# EAGLE board PCB (EAGLE 9.6.2), part 1 of 2
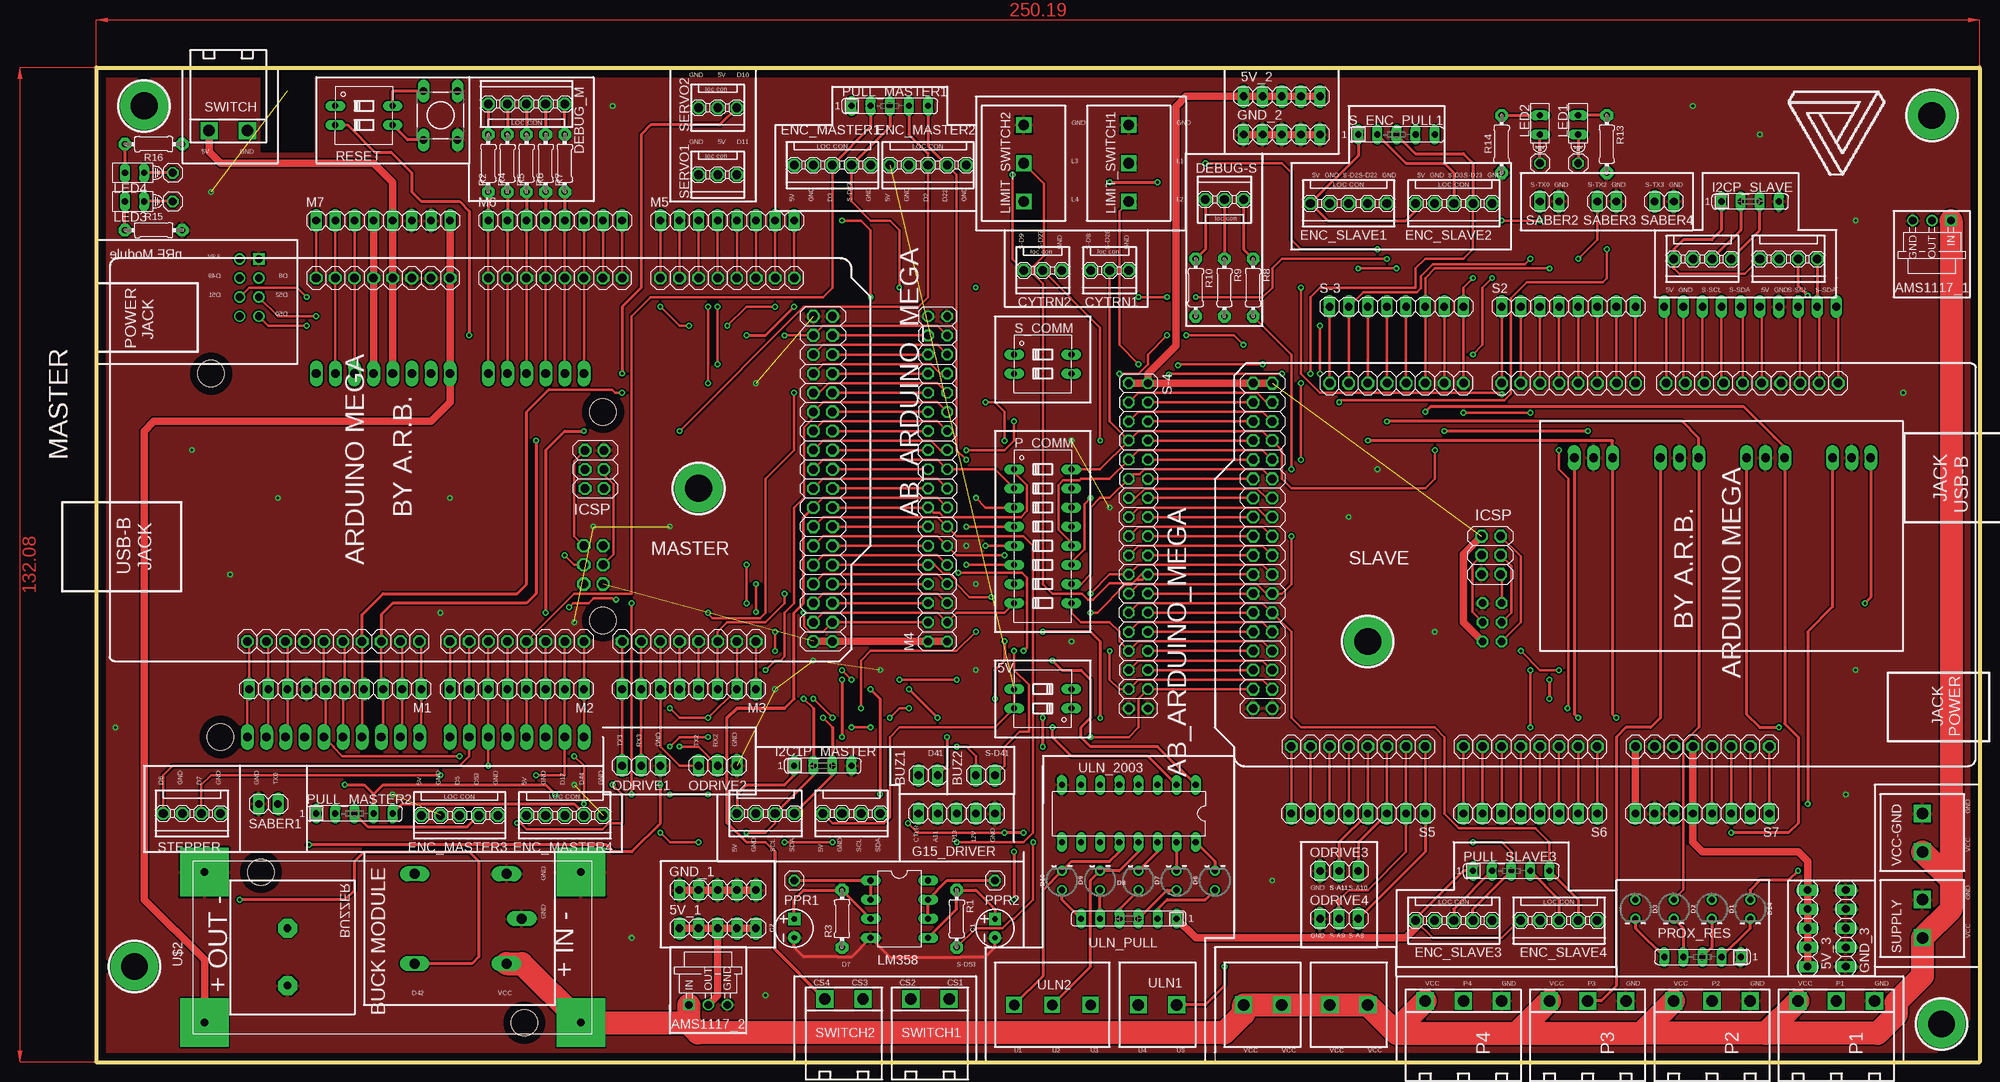
[diagram p1: board, top side]
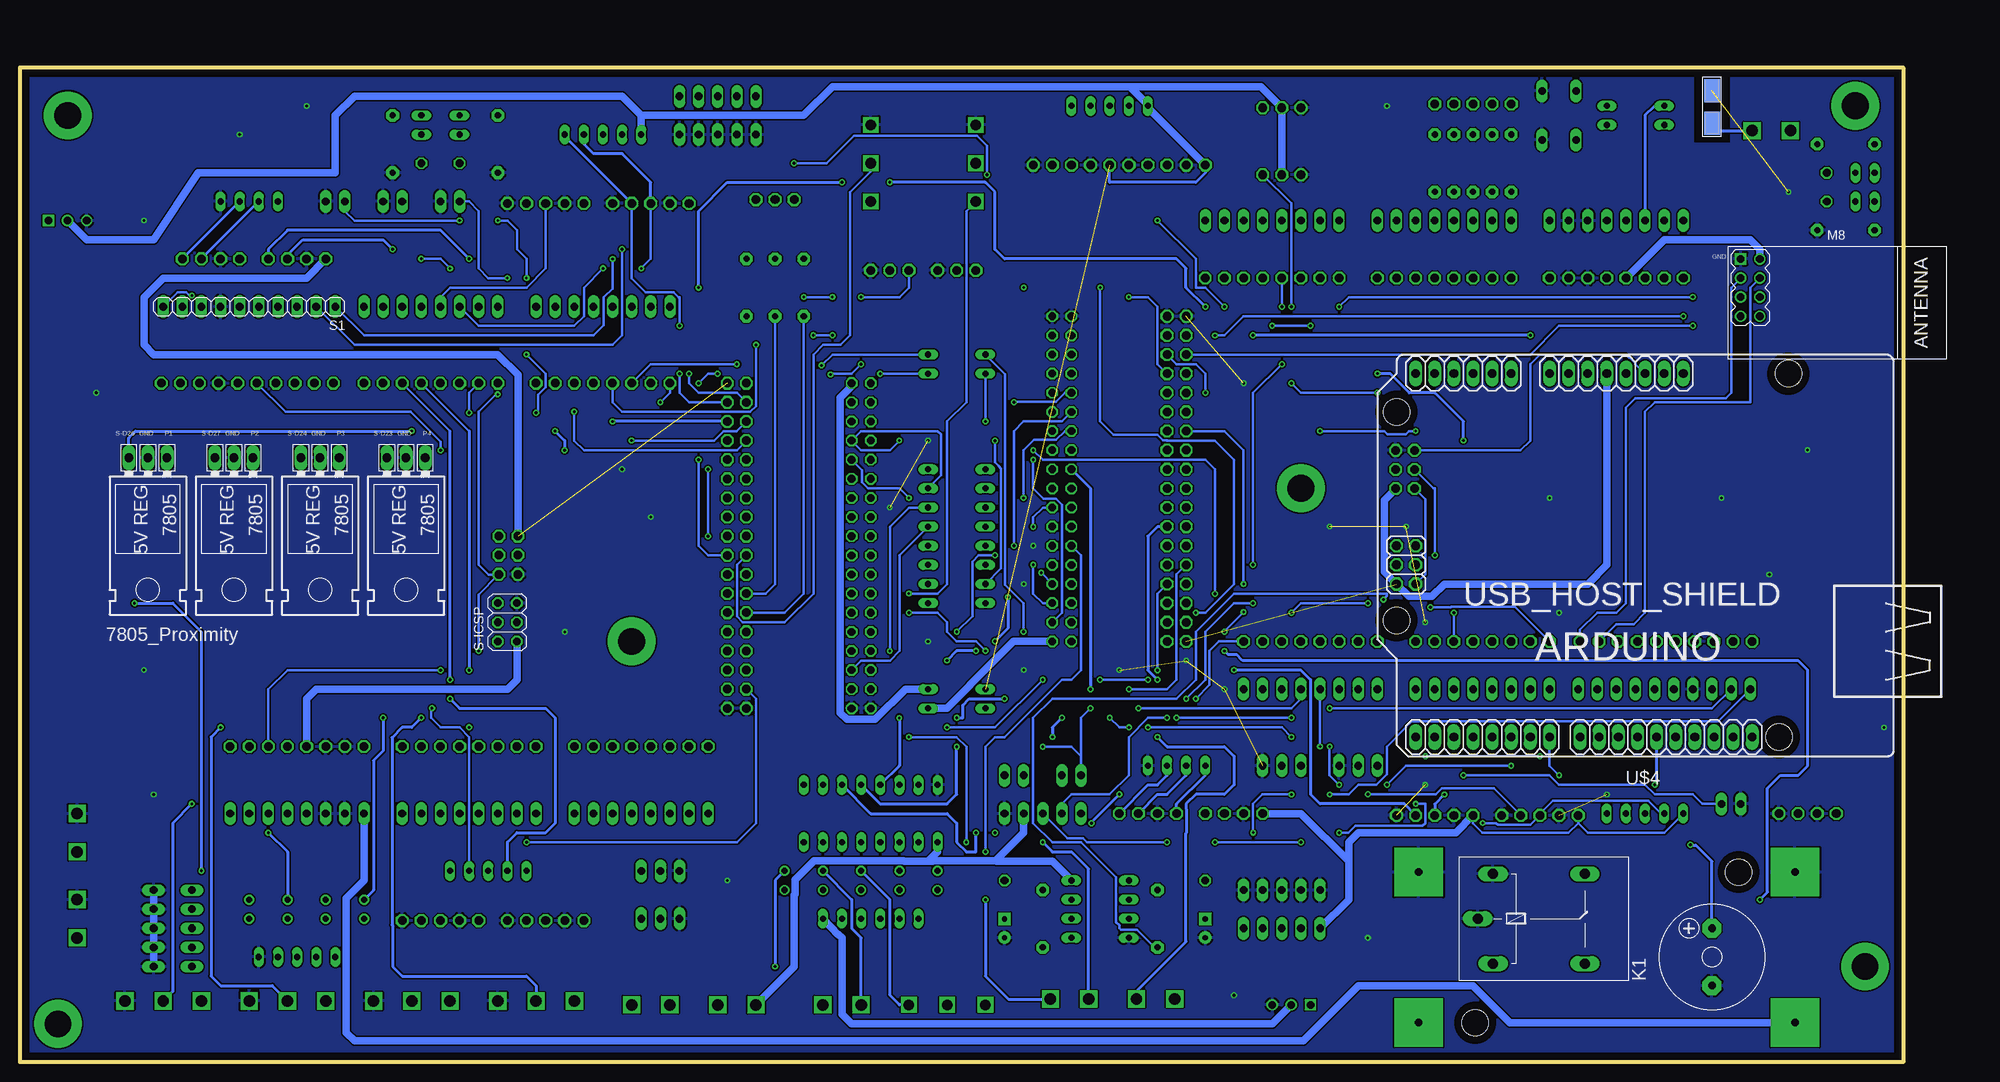
[diagram p2: board, bottom side, seen from below]

Size 250.19 x 132.08 mm. Coordinates in mm from the lower left corner, seen from the top.
Outline: 0,132.08 0,0 250.19,0 250.19,132.08 0,132.08
Copper layers (1*16): Top 0.035mm / dielectric 1.5mm / Bottom 0.035mm
Design rules "default *": minimum track width 10mil, minimum drill 0.35mm, track to track 6mil, track to pad 6mil, pad to pad 6mil, via to via 6mil, smd to smd 6mil, copper to edge 40mil, drill to drill 6mil, minimum pad ring 10mil, minimum via ring 8mil, stop-mask expansion 4mil, vias tented up to drill 0mil, thermal gap 10mil
Net classes: 0 default: width 0.127 mm, drill 0.279 mm, clearance 0.203 mm; 1 arduino master: width 0.305 mm, drill 0.356 mm, clearance 0.254 mm; 2 arduino slave: width 0.305 mm, drill 0.356 mm, clearance 0.254 mm; 3 proximity: width 0.406 mm, drill 0.381 mm, clearance 0.305 mm; 4 vin: width 1.016 mm, drill 0.356 mm, clearance 0.305 mm

## Footprints (pad centres in the part's own frame; a part is rotated, then mirrored left to right if it is on the bottom)
DIP02YL = drill 0.813 long: 1 -1.27,-3.81; 2 1.27,-3.81; 3 1.27,3.81; 4 -1.27,3.81
1X05 = drill 1.016 long: 1 -5.08,0; 2 -2.54,0; 3 0,0; 4 2.54,0; 5 5.08,0
REG-AMS1117-3P#V = drill 1 square: 1 -2.54,-5.08 | drill 1: 2 0,-5.08; 3 2.54,-5.08
1X02 = drill 1.016 long: 1 -1.27,0; 2 1.27,0
F/CM12P = drill 1.016 pad 2.54 octagon: + 3.81,0; - -3.81,0
CPOL-RADIAL-2.5MM-5MM = drill 0.7 pad 1.651 square: 1 1.25,0 | drill 0.7 pad 1.651: 2 -1.25,0
AB_3PIN_LOC_CONNECTOR = drill 1.143 octagon: 1 -1.524,-2.54; 2 -1.524,0; 3 -1.524,2.54
LED_3MM-NS = drill 0.813: A -1.27,0; K 1.27,0
AB_5PIN_LOC_CONNECTOR = drill 1.143 octagon: 1 -1.524,-5.08; 2 -1.524,-2.54; 3 -1.524,0; 4 -1.524,2.54; 5 -1.524,5.08
SIL4 = drill 0.813 long: 1 -3.81,0; 2 -1.27,0; 3 1.27,0; 4 3.81,0
AB_4PIN_LOC_CONNECTOR = drill 1.143 octagon: 1 0,-3.81; 2 0,-1.27; 3 0,1.27; 4 0,3.81
G5LE = drill 1.321 long: 1 -7.493,-5.969; 2 -7.493,5.969; O 4.699,5.969; P -9.525,0; S 4.699,-5.969
HLMP6 = drill 0.813 long: A -1.27,0; K 1.27,0
AB_SCREW_TER_5MM_3PIN = drill 1.397 square: 1 2.54,5.08; 2 2.54,0; 3 2.54,-5.08
DIL08 = drill 0.813 long: 1 -3.81,-3.81; 2 -1.27,-3.81; 3 1.27,-3.81; 4 3.81,-3.81; 5 3.81,3.81; 6 1.27,3.81; 7 -1.27,3.81; 8 -3.81,3.81
1X10 = drill 1.016 long: 1 -11.43,0; 2 -8.89,0; 3 -6.35,0; 4 -3.81,0; 5 -1.27,0; 6 1.27,0; 7 3.81,0; 8 6.35,0; 9 8.89,0; 10 11.43,0
1X08 = drill 1.016 long: 1 -8.89,0; 2 -6.35,0; 3 -3.81,0; 4 -1.27,0; 5 1.27,0; 6 3.81,0; 7 6.35,0; 8 8.89,0
2X18 = drill 1.016 octagon: 1 -21.59,-1.27; 2 -21.59,1.27; 3 -19.05,-1.27; 4 -19.05,1.27; 5 -16.51,-1.27; 6 -16.51,1.27; 7 -13.97,-1.27; 8 -13.97,1.27; 9 -11.43,-1.27; 10 -11.43,1.27; 11 -8.89,-1.27; 12 -8.89,1.27; 13 -6.35,-1.27; 14 -6.35,1.27; 15 -3.81,-1.27; 16 -3.81,1.27; 17 -1.27,-1.27; 18 -1.27,1.27; 19 1.27,-1.27; 20 1.27,1.27; 21 3.81,-1.27; 22 3.81,1.27; 23 6.35,-1.27; 24 6.35,1.27; 25 8.89,-1.27; 26 8.89,1.27; 27 11.43,-1.27; 28 11.43,1.27; 29 13.97,-1.27; 30 13.97,1.27; 31 16.51,-1.27; 32 16.51,1.27; 33 19.05,-1.27; 34 19.05,1.27; 35 21.59,-1.27; 36 21.59,1.27
WIRELESS-NRF24L01 = drill 1 square: 1 -12.7,6.35 | drill 1: 2 -10.16,6.35; 3 -12.7,3.81; 4 -10.16,3.81; 5 -12.7,1.27; 6 -10.16,1.27; 7 -12.7,-1.27; 8 -10.16,-1.27
AB_ARDUINO_MEGA = drill 1.13 octagon: 3V3 24.13,21.59; 5V 24.13,19.05; 5V1 -24.13,-36.83; 5V2 -24.13,-39.37; 5V3 -3.81,-9.017; - 24.13,29.21; A0 24.13,6.35; A1 24.13,3.81; A2 24.13,1.27; A3 24.13,-1.27; A4 24.13,-3.81; A5 24.13,-6.35; A6 24.13,-8.89; A7 24.13,-11.43; A8 24.13,-16.51; A9 24.13,-19.05; A10 24.13,-21.59; A11 24.13,-24.13; A12 24.13,-26.67; A13 24.13,-29.21; A14 24.13,-31.75; A15 24.13,-34.29; AREF -24.13,33.274; D2 -24.13,-1.27; D3 -24.13,1.27; D4 -24.13,3.81; D5 -24.13,6.35; D6 -24.13,8.89; D7 -24.13,11.43; D8 -24.13,15.494; D9 -24.13,18.034; D10 -24.13,20.574; D11 -24.13,23.114; D12 -24.13,25.654; D13 -24.13,28.194; D22 -21.59,-36.83; D23 -21.59,-39.37; D24 -19.05,-36.83; D25 -19.05,-39.37; D26 -16.51,-36.83; D27 -16.51,-39.37; D28 -13.97,-36.83; D29 -13.97,-39.37; D30 -11.43,-36.83; D31 -11.43,-39.37; D32 -8.89,-36.83; D33 -8.89,-39.37; D34 -6.35,-36.83; D35 -6.35,-39.37; D36 -3.81,-36.83; D37 -3.81,-39.37; D38 -1.27,-36.83; D39 -1.27,-39.37; D40 1.27,-36.83; D41 1.27,-39.37; D42 3.81,-36.83; D43 3.81,-39.37; D44 6.35,-36.83; D45 6.35,-39.37; D46 8.89,-36.83; D47 8.89,-39.37; D48 11.43,-36.83; D49 11.43,-39.37; D50 13.97,-36.83; D51 13.97,-39.37; D52 16.51,-36.83; D53 16.51,-39.37; GD3 19.05,-36.83; GD4 19.05,-39.37; GND 24.13,13.97; GND1 24.13,16.51; GND2 -24.13,30.734; GND5 1.245,-9.017; IOREF 24.13,26.67; MISO -3.81,-6.502; MOSI -1.295,-9.017; RST 24.13,24.13; RST1 1.245,-6.502; RX0 -24.13,-6.35; RX1 -24.13,-24.13; RX2 -24.13,-19.05; RX3 -24.13,-13.97; SCK -1.295,-6.502; SCL -24.13,-29.21; SCLU -24.13,38.354; SDA -24.13,-26.67; SDAU -24.13,35.814; TX0 -24.13,-3.81; TX1 -24.13,-21.59; TX2 -24.13,-16.51; TX3 -24.13,-11.43; VIN 24.13,11.43
1X03 = drill 1.016 long: 1 -2.54,0; 2 0,0; 3 2.54,0
AB_RIGHT_TER_BLK_3PIN = drill 1.524 square: 1 -5.588,5.08; 2 -5.588,0; 3 -5.588,-5.08
DIP08YL = drill 0.813 long: 1 -8.89,-3.81; 2 -6.35,-3.81; 3 -3.81,-3.81; 4 -1.27,-3.81; 5 1.27,-3.81; 6 3.81,-3.81; 7 6.35,-3.81; 8 8.89,-3.81; 9 8.89,3.81; 10 6.35,3.81; 11 3.81,3.81; 12 1.27,3.81; 13 -1.27,3.81; 14 -3.81,3.81; 15 -6.35,3.81; 16 -8.89,3.81
1X01 = drill 1.016 octagon: 1 0,0
SIL5 = drill 0.813 long: 1 -5.08,0; 2 -2.54,0; 3 0,0; 4 2.54,0; 5 5.08,0
0204/7 = drill 0.813 pad 1.676 octagon: 1 -3.81,0; 2 3.81,0
DTS-6 = drill 1 long: 1 -3.25,2.25; 2 3.25,2.25; 3 -3.25,-2.25; 4 3.25,-2.25
2X03 = drill 1.016 octagon: 1 -2.54,-1.27; 2 -2.54,1.27; 3 0,-1.27; 4 0,1.27; 5 2.54,-1.27; 6 2.54,1.27
AB_SCREW_TERMINAL_5MM_2PIN = drill 1.524 square: 1 0,2.54; 2 0,-2.54
AB_RIGHT_TER_BLK = drill 1.524 square: 1 -5.842,2.794; 2 -5.842,-2.286
BUCK_MODULE = drill 1 pad 6.452 square: 1 -10,-25; 2 10,-25; 3 -10,25; 4 10,25 | hole 3.5: -10,-17.5; 10,17.5
PLATED_DRILL_3.5MM = drill 3.556 pad 6.35: 1 0,0
AB_USB_HOST_SHIELD_ARDUINO = drill 1.143 long: 3V3 1.27,-24.13; 5V1 3.81,-24.13; - -6.35,-24.13; A0 16.51,-24.13; A1 19.05,-24.13; A2 21.59,-24.13; A3 24.13,-24.13; A4 26.67,-24.13; A5 29.21,-24.13; AREF -10.414,24.13; D2 24.13,24.13; D3 21.59,24.13; D4 19.05,24.13; D5 16.51,24.13; D6 13.97,24.13; D7 11.43,24.13; D8 7.366,24.13; D9 4.826,24.13; D10 2.286,24.13; D11 -0.254,24.13; D12 -2.794,24.13; D13 -5.334,24.13; GND -7.874,24.13; GND2 8.89,-24.13; GND3 6.35,-24.13; RST1 -1.27,-24.13; RX0 29.21,24.13; SCL -15.494,24.13; SDA -12.954,24.13; TX0 26.67,24.13; VIN 11.43,-24.13; VREF -3.81,-24.13 | drill 1.168 octagon: 5V 31.75,3.81; GND1 31.75,-1.27; MISO 29.21,3.81; MOSI 31.75,1.27; RST 29.21,-1.27; SCK 29.21,1.27 | hole 3.56: 31.75,-19.05; 31.75,8.636; -19.05,24.13; -20.32,-24.13
AB_7805_FLAT = drill 1.143 long: 1 -7.874,1.778; 2 -7.874,-0.762; 3 -7.874,-3.302
AB_JUMPER_ONE_WAY = smd 3.048 x 2.032: 1 -2.286,0; 2 2.032,0
DIL16 = drill 0.813 long: 1 -8.89,-3.81; 2 -6.35,-3.81; 3 -3.81,-3.81; 4 -1.27,-3.81; 5 1.27,-3.81; 6 3.81,-3.81; 7 6.35,-3.81; 8 8.89,-3.81; 9 8.89,3.81; 10 6.35,3.81; 11 3.81,3.81; 12 1.27,3.81; 13 -1.27,3.81; 14 -3.81,3.81; 15 -6.35,3.81; 16 -8.89,3.81
SIL6 = drill 0.813 long: 1 -6.35,0; 2 -3.81,0; 3 -1.27,0; 4 1.27,0; 5 3.81,0; 6 6.35,0

## Placement (x,y rotation side)
5V  [DIP02YL]  125.73,48.26 90 top
5V_1  [1X05]  82.55,17.78 0 top
5V_2  [1X05]  157.48,128.27 180 top
5V_3  [1X05]  227.33,17.78 270 top
AMS1117_1  REG-AMS1117-3P-5.0V#V  [REG-AMS1117-3P#V]  243.84,106.68 180 top
AMS1117_2  REG-AMS1117-3P-5.0V#V  [REG-AMS1117-3P#V]  81.28,12.7 0 top
BUZ1  [1X02]  110.49,38.1 0 top
BUZ2  [1X02]  118.11,38.1 0 top
BUZZER  F/CM12P  [F/CM12P]  25.4,13.97 90 bottom
C1  10uF  [CPOL-RADIAL-2.5MM-5MM]  119.38,17.78 90 top
C2  10uF  [CPOL-RADIAL-2.5MM-5MM]  92.71,17.78 90 top
CYTRN1  AB_3PIN_LOC_CONNECTOR  [AB_3PIN_LOC_CONNECTOR]  134.62,106.68 90 top
CYTRN2  AB_3PIN_LOC_CONNECTOR  [AB_3PIN_LOC_CONNECTOR]  125.73,106.68 90 top
D1  [LED_3MM-NS]  214.63,20.32 270 top
D2  [LED_3MM-NS]  209.55,20.32 270 top
D3  [LED_3MM-NS]  204.47,20.32 270 top
D6  [LED_3MM-NS]  148.59,24.13 90 top
D7  [LED_3MM-NS]  143.51,24.13 90 top
D8  [LED_3MM-NS]  138.43,24.13 90 top
D9  [LED_3MM-NS]  133.35,24.13 90 top
D10  [LED_3MM-NS]  128.27,24.13 90 top
D14  [LED_3MM-NS]  219.71,20.32 270 top
DEBUG-S  AB_3PIN_LOC_CONNECTOR  [AB_3PIN_LOC_CONNECTOR]  149.86,113.03 270 top
DEBUG_M  AB_5PIN_LOC_CONNECTOR  [AB_5PIN_LOC_CONNECTOR]  57.15,125.73 270 top
ENC_MASTER1  AB_5PIN_LOC_CONNECTOR  [AB_5PIN_LOC_CONNECTOR]  97.79,120.65 90 top
ENC_MASTER2  AB_5PIN_LOC_CONNECTOR  [AB_5PIN_LOC_CONNECTOR]  110.49,120.65 90 top
ENC_MASTER3  AB_5PIN_LOC_CONNECTOR  [AB_5PIN_LOC_CONNECTOR]  48.26,34.29 90 top
ENC_MASTER4  AB_5PIN_LOC_CONNECTOR  [AB_5PIN_LOC_CONNECTOR]  62.23,34.29 90 top
ENC_SLAVE1  AB_5PIN_LOC_CONNECTOR  [AB_5PIN_LOC_CONNECTOR]  166.37,115.57 90 top
ENC_SLAVE2  AB_5PIN_LOC_CONNECTOR  [AB_5PIN_LOC_CONNECTOR]  180.34,115.57 90 top
ENC_SLAVE3  AB_5PIN_LOC_CONNECTOR  [AB_5PIN_LOC_CONNECTOR]  180.34,20.32 90 top
ENC_SLAVE4  AB_5PIN_LOC_CONNECTOR  [AB_5PIN_LOC_CONNECTOR]  194.31,20.32 90 top
G15_DRIVER  [1X05]  114.3,33.02 180 top
GND_1  [1X05]  82.55,22.86 0 top
GND_2  [1X05]  157.48,123.19 180 top
GND_3  [1X05]  232.41,17.78 270 top
I2C1P_MASTER  [SIL4]  96.52,39.37 0 top
I2CP_SLAVE  [SIL4]  219.71,114.3 0 top
IMU_BLOCK2  AB_4PIN_LOC_CONNECTOR  [AB_4PIN_LOC_CONNECTOR]  100.33,33.02 90 top
IMU_BLOCK3  AB_4PIN_LOC_CONNECTOR  [AB_4PIN_LOC_CONNECTOR]  213.36,106.68 90 top
IMU_BLOCK4  AB_4PIN_LOC_CONNECTOR  [AB_4PIN_LOC_CONNECTOR]  224.79,106.68 90 top
IMU_MASTER  AB_4PIN_LOC_CONNECTOR  [AB_4PIN_LOC_CONNECTOR]  88.9,33.02 90 top
K1  G5LE  [G5LE]  46.99,19.05 0 bottom
LED1  HLMP6  [HLMP6]  196.85,124.46 90 top
LED2  HLMP6  [HLMP6]  191.77,124.46 90 top
LED3  HLMP6  [HLMP6]  5.08,114.3 180 top
LED4  HLMP6  [HLMP6]  5.08,118.11 180 top
LIMIT_SWITCH1  AB_SCREW_TER_5MM_3PIN  [AB_SCREW_TER_5MM_3PIN]  139.7,119.38 180 top
LIMIT_SWITCH2  AB_SCREW_TER_5MM_3PIN  [AB_SCREW_TER_5MM_3PIN]  125.73,119.38 180 top
LM358  [DIL08]  106.68,20.32 270 top
M1  [1X10]  31.75,49.53 180 top
M2  [1X08]  55.88,49.53 180 top
M3  [1X08]  78.74,49.53 180 top
M4  [2X18]  111.76,77.47 90 top
M5  [1X08]  83.82,111.76 0 top
M6  [1X08]  60.96,111.76 0 top
M7  [1X08]  38.1,111.76 0 top
M8  WIRELESS-NRF24L01  [WIRELESS-NRF24L01]  8.89,100.33 0 bottom
MASTER  AB_ARDUINO_MEGA  [AB_ARDUINO_MEGA]  58.42,80.01 90 top
ODRIVE1  [1X03]  72.39,39.37 180 top
ODRIVE2  [1X03]  82.55,39.37 180 top
ODRIVE3  [1X03]  165.1,25.4 0 top
ODRIVE4  [1X03]  165.1,19.05 0 top
P1  P1  [AB_RIGHT_TER_BLK_3PIN]  231.14,2.54 270 top
P2  P2  [AB_RIGHT_TER_BLK_3PIN]  214.63,2.54 270 top
P3  P3  [AB_RIGHT_TER_BLK_3PIN]  198.12,2.54 270 top
P4  P4  [AB_RIGHT_TER_BLK_3PIN]  181.61,2.54 270 top
P_COMM  [DIP08YL]  125.73,69.85 270 top
PPR1  [1X01]  92.71,24.13 0 top
PPR2  [1X01]  119.38,24.13 0 top
PPR5  [1X01]  196.85,119.38 0 top
PPR6  [1X01]  191.77,119.38 0 top
PPR7  [1X01]  10.16,114.3 0 top
PPR8  [1X01]  10.16,118.11 0 top
PROX_RES  [SIL5]  213.36,13.97 180 top
PULL_MASTER1  [SIL5]  105.41,127 0 top
PULL_MASTER2  [SIL5]  34.29,33.02 0 top
PULL_SLAVE3  [SIL5]  187.96,25.4 0 top
R1  4.7K  [0204/7]  114.3,19.05 270 top
R2  [0204/7]  52.07,119.38 270 top
R3  4.7K  [0204/7]  99.06,19.05 90 top
R4  [0204/7]  54.61,119.38 270 top
R5  [0204/7]  57.15,119.38 270 top
R6  [0204/7]  59.69,119.38 270 top
R7  [0204/7]  62.23,119.38 270 top
R8  [0204/7]  153.67,102.87 270 top
R9  [0204/7]  149.86,102.87 270 top
R10  [0204/7]  146.05,102.87 270 top
R13  1K Ohm  [0204/7]  200.66,121.92 270 top
R14  1K Ohm  [0204/7]  186.69,121.92 270 top
R15  1K Ohm  [0204/7]  7.62,110.49 0 top
R16  1K Ohm  [0204/7]  7.62,121.92 0 top
RESET  [DIP02YL]  35.56,125.73 270 top
RST_SWITCH  DTS-6  [DTS-6]  45.72,125.73 90 top
S1  [1X10]  219.71,100.33 180 bottom
S2  [1X08]  195.58,100.33 0 top
S5  [1X08]  167.64,33.02 180 top
S6  [1X08]  190.5,33.02 180 top
S7  [1X08]  213.36,33.02 180 top
S-3  [1X08]  172.72,100.33 0 top
S-4  [2X18]  138.43,68.58 270 top
S-ICSP  [2X03]  185.42,58.42 90 bottom
S_COMM  [DIP02YL]  125.73,92.71 270 top
S_ENC_PULL1  [SIL5]  172.72,123.19 0 top
SABER1  [1X02]  22.86,34.29 0 top
SABER2  [1X02]  193.04,114.3 180 top
SABER3  [1X02]  200.66,114.3 180 top
SABER4  [1X02]  208.28,114.3 180 top
SERVO1  AB_3PIN_LOC_CONNECTOR  [AB_3PIN_LOC_CONNECTOR]  82.55,119.38 90 top
SERVO2  AB_3PIN_LOC_CONNECTOR  [AB_3PIN_LOC_CONNECTOR]  82.55,128.27 90 top
SLAVE  AB_ARDUINO_MEGA  [AB_ARDUINO_MEGA]  193.04,66.04 270 top
STEPPER  AB_4PIN_LOC_CONNECTOR  [AB_4PIN_LOC_CONNECTOR]  12.7,33.02 90 top
SUPPLY  AB_SCREW_TERMINAL_5MM_2PIN  [AB_SCREW_TERMINAL_5MM_2PIN]  242.57,19.05 180 top
SWITCH  AB_RIGHT_TER_BLK  [AB_RIGHT_TER_BLK]  17.78,129.54 90 top
SWITCH1  AB_RIGHT_TER_BLK  [AB_RIGHT_TER_BLK]  110.49,2.54 270 top
SWITCH2  AB_RIGHT_TER_BLK  [AB_RIGHT_TER_BLK]  99.06,2.54 270 top
U$2  BUCK_MODULEWITH_SMDPADS&THROUGHHOLES  [BUCK_MODULE]  39.37,15.24 90 top
U$3  PLATED_DRILL_3.5MM  [PLATED_DRILL_3.5MM]  80.01,76.2 0 top
U$4  AB_USB_HOST_SHIELD_ARDUINO  [AB_USB_HOST_SHIELD_ARDUINO]  35.56,67.31 180 bottom
U$5  PLATED_DRILL_3.5MM  [PLATED_DRILL_3.5MM]  168.91,55.88 0 top
U$6  PLATED_DRILL_3.5MM  [PLATED_DRILL_3.5MM]  245.11,5.08 0 top
U$7  PLATED_DRILL_3.5MM  [PLATED_DRILL_3.5MM]  243.84,125.73 0 top
U$8  PLATED_DRILL_3.5MM  [PLATED_DRILL_3.5MM]  5.08,12.7 0 top
U$9  PLATED_DRILL_3.5MM  [PLATED_DRILL_3.5MM]  6.35,127 0 top
U$23  AB_7805_FLAT  [AB_7805_FLAT]  232.41,72.39 270 bottom
U$24  AB_7805_FLAT  [AB_7805_FLAT]  220.98,72.39 270 bottom
U$25  AB_7805_FLAT  [AB_7805_FLAT]  209.55,72.39 270 bottom
U$26  AB_7805_FLAT  [AB_7805_FLAT]  198.12,72.39 270 bottom
U$35  AB_JUMPER_ONE_WAY  [AB_JUMPER_ONE_WAY]  25.4,127 90 bottom
ULN1  AB_SCREW_TERMINAL_5MM_2PIN  [AB_SCREW_TERMINAL_5MM_2PIN]  140.97,7.62 90 top
ULN2  AB_SCREW_TER_5MM_3PIN  [AB_SCREW_TER_5MM_3PIN]  127,5.08 90 top
ULN_2003  [DIL16]  137.16,33.02 180 top
ULN_PULL  [SIL6]  137.16,19.05 180 top
ULN_SUPPLY  AB_SCREW_TERMINAL_5MM_2PIN  [AB_SCREW_TERMINAL_5MM_2PIN]  166.37,7.62 90 top
ULN_SUPPLY1  AB_SCREW_TERMINAL_5MM_2PIN  [AB_SCREW_TERMINAL_5MM_2PIN]  154.94,7.62 90 top
VCC-GND  AB_SCREW_TERMINAL_5MM_2PIN  [AB_SCREW_TERMINAL_5MM_2PIN]  242.57,30.48 180 top